# Altium project SAU-G0-EX_AHT-GL.PrjPcb
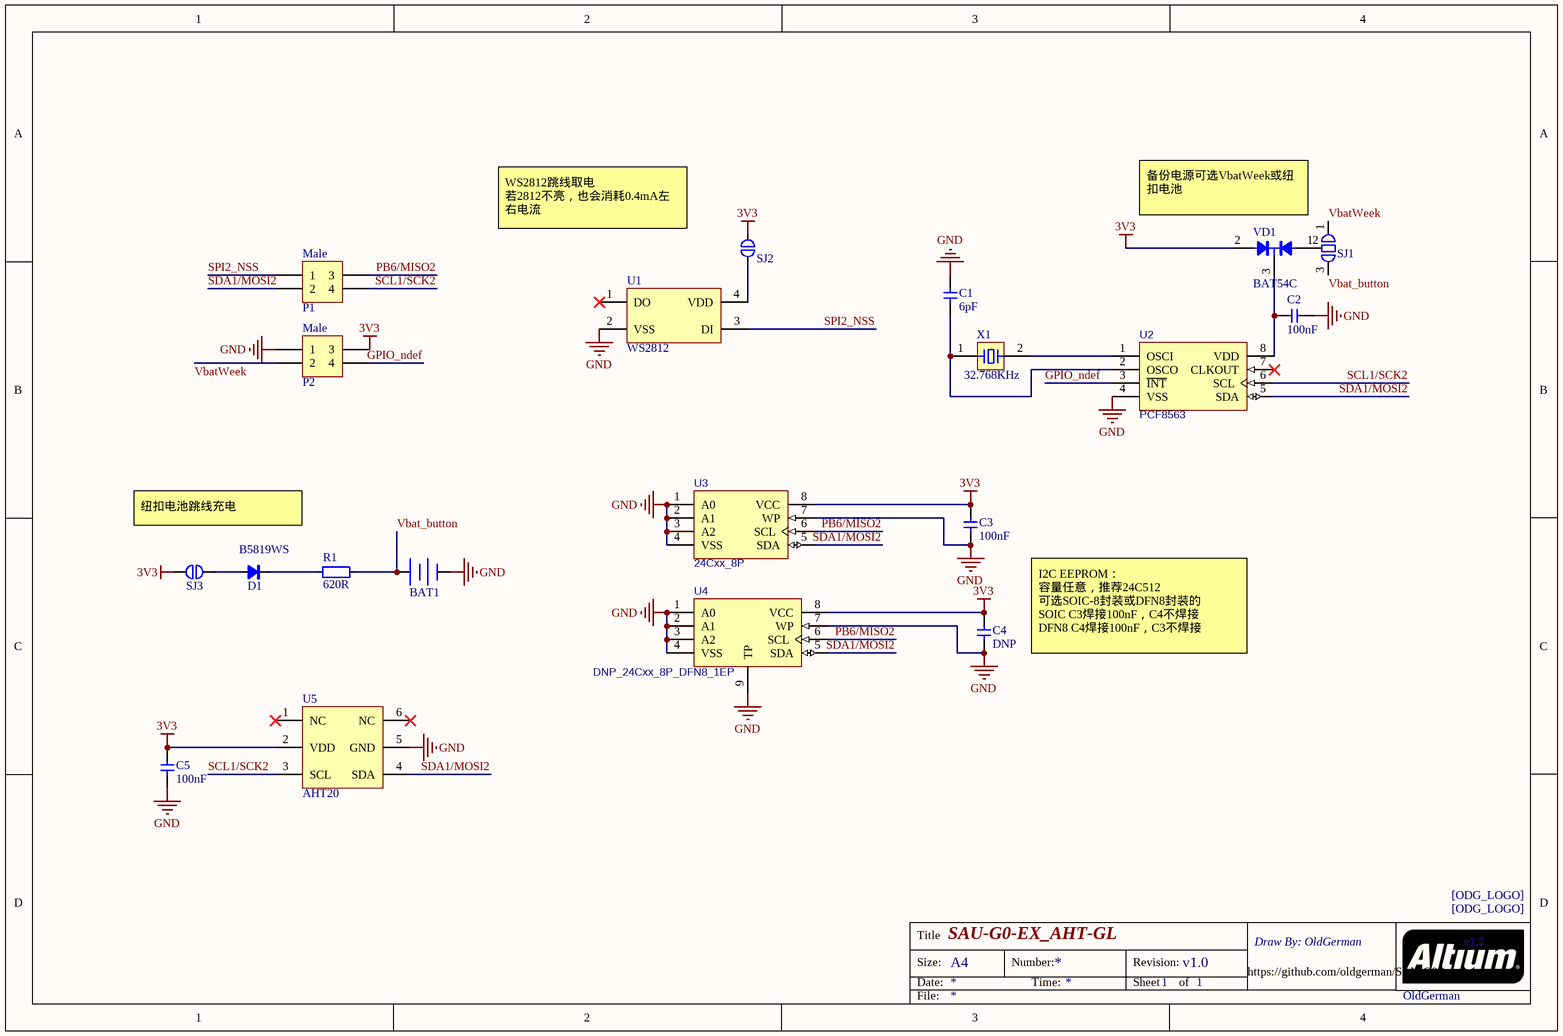
[diagram p0: SAU-G0-EX_AHT-GL.SchDoc]
1 sheet, 22 parts. Net scope: global (net labels, ports and power ports of the same name join across sheets).
Board file: SAU-G0-EX_AHT-GL.PcbDoc

## Sheet SAU-G0-EX_AHT-GL.SchDoc: SAU-G0-EX_AHT-GL
size A4; Address1: Draw By: OldGerman; Revision: v1.0; SheetNumber: 1; SheetTotal: 1

### Parts
BAT1  BAT  [MS621FE-FL11E]  (value not drawn)
C1  6pF  [C0603]
C2  100nF  [C0603]
C3  100nF  [C0603]
C4  DNP  [C0402]
C5  100nF  [C0603]
D1  B5819WS  [SOD-323]
ODG1  ODG_LOGO  [ODG_LOGO_soldermask]  (value not drawn)
ODG2  ODG_LOGO  [ODG_LOGO_soldermask]  (value not drawn)
P1  Male  [2.0mm_Male_2x2]
P2  Male  [2.0mm_Male_2x2]
R1  620R  [R0603]
SJ1  SJ_3P  [SJ_3P_MINI]  (value not drawn)
SJ2  SJ_2P  [SJ_2P_MINI]  (value not drawn)
SJ3  SJ_2P  [SJ_2P_MINI]  (value not drawn)
U1  WS2812  [WS2812_2020]
U2  PCF8563  [ANALOG DEV SOIC-8 R8]
U3  24Cxx_8P  [ANALOG DEV SOIC-8 R8]
U4  DNP_24Cxx_8P_DFN8_1EP  [DFN-8-1EP_3x2mm_P0.5mm_EP1.75x1.45mm]
U5  AHT20  [AHT20]
VD1  BAT54C  [DIODES SOT-323-3]
X1  32.768KHz  [XTAL_2P_3215]

### Nets
3V3: C3.1 C4.1 C5.1 P2.3 SJ2.1 SJ3.2 U3.8(VCC) U4.8(VCC) U5.2(VDD) VD1.2
GND: BAT1.2(-) C1.1 C2.2 C3.2 C4.2 C5.2 P2.1 U1.2(VSS) U2.4(VSS) U3.1(A0) U3.2(A1) U3.3(A2) U3.4(VSS) U3.7(WP) U4.1(A0) U4.2(A1) U4.3(A2) U4.4(VSS) U4.7(WP) U4.9(TP) U5.5(GND)
GPIO_ndef: P2.4 U2.3(~{INT})
PB6/MISO2: P1.3 U3.6(SCL) U4.6(SCL)
SCL1/SCK2: P1.4 U2.6(SCL) U5.3(SCL)
SDA1/MOSI2: P1.2 U2.5(SDA) U3.5(SDA) U4.5(SDA) U5.4(SDA)
SPI2_NSS: P1.1 U1.3(DI)
Vbat_button: BAT1.1(+) R1.2 SJ1.3
VbatWeek: P2.2 SJ1.1
NetC1_2: C1.2 U2.2(OSCO) X1.1
NetC2_1: C2.1 U2.8(VDD) VD1.3
NetD1_1: D1.1(A) SJ3.1
NetD1_2: D1.2(C) R1.1
NetSJ1_2: SJ1.2 VD1.1
NetSJ2_2: SJ2.2 U1.4(VDD)
NetU2_1: U2.1(OSCI) X1.2

Not connected (* = marked no-connect by the designer): U1 1(DO)*; U2 7(CLKOUT)*; U5 1(NC)* 6(NC)*

### Notes on the sheet
- WS2812跳线取电
  若2812不亮，也会消耗0.4mA左右电流
- 备份电源可选VbatWeek或纽扣电池
- 纽扣电池跳线充电
- I2C EEPROM：
  容量任意，推荐24C512
  可选SOIC-8封装或DFN8封装的
  SOIC C3焊接100nF，C4不焊接
  DFN8 C4焊接100nF，C3不焊接
- https://github.com/oldgerman/SAU-G0
- v1.0
- OldGerman
- Title
- Size:
- Date:
- A4
- Number:
- Time:
- Revision:
- Sheet
- of
- File:
- (in symbol ODG_LOGO) [ODG_LOGO]

### Library data of the parts
BAT1 = BAT: 锂电池; Auther: JonesLee; Value: BAT; Publish: 11-4-2017
C1-C5 = CAP: Capacitor; Value: 0.1u
D1 = DIODE: 二极管
P1 P2 = CONN_2X2
R1 = RES: Resistor; Value: 22R
SJ1 = SJ_3P: 焊接跳线二选一
SJ2 SJ3 = SJ_2P: 焊接跳线
U4 = 24Cxx_8P_DFN8_1EP
U5 = AHT20: 线性稳压芯片; BOM名称: 可调升压芯片; 版权归属: 源创客; 学习资源: www.ooocke.com
VD1 = BAT54C: 贴片肖特基二极管; BOM名称: 肖特基二极管; 版权归属: 源创客; 属性: 30V/0.2A; 学习资源: www.ooocke.com
X1 = XTAL-2P: 2脚无源石英晶振; BOM名称: 4脚无源晶振; 版权归属: 源创客; 学习资源: www.ooocke.com